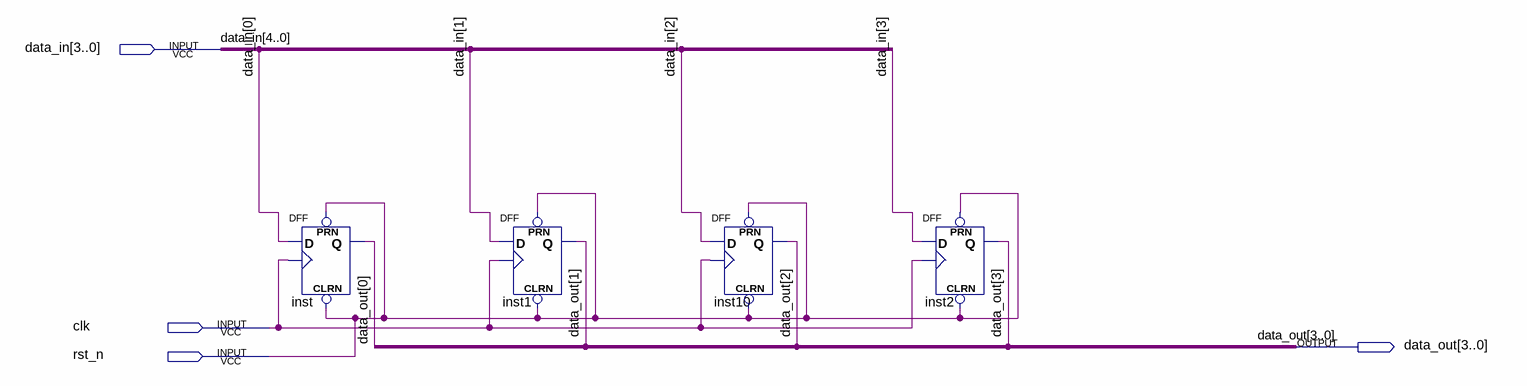
[diagram p0: schematic sheet]
// Quartus schematic reg_5bit.bdf as structural Verilog: 4 symbols, 4 pins
module reg_5bit (
  input  [3:0] data_in,
  input  clk,
  input  rst_n,
  output [3:0] data_out
);

  DFF inst (.CLRN(rst_n), .CLK(clk), .D(data_in[0]), .PRN(rst_n), .Q(data_out[0]));
  DFF inst1 (.CLRN(rst_n), .CLK(clk), .D(data_in[1]), .PRN(rst_n), .Q(data_out[1]));
  DFF inst10 (.CLRN(rst_n), .CLK(clk), .D(data_in[2]), .PRN(rst_n), .Q(data_out[2]));
  DFF inst2 (.CLRN(rst_n), .CLK(clk), .D(data_in[3]), .PRN(rst_n), .Q(data_out[3]));
endmodule
